# EAGLE design SSTuino_Evo (EAGLE 9.6.2)

## Sheet 1 of 2
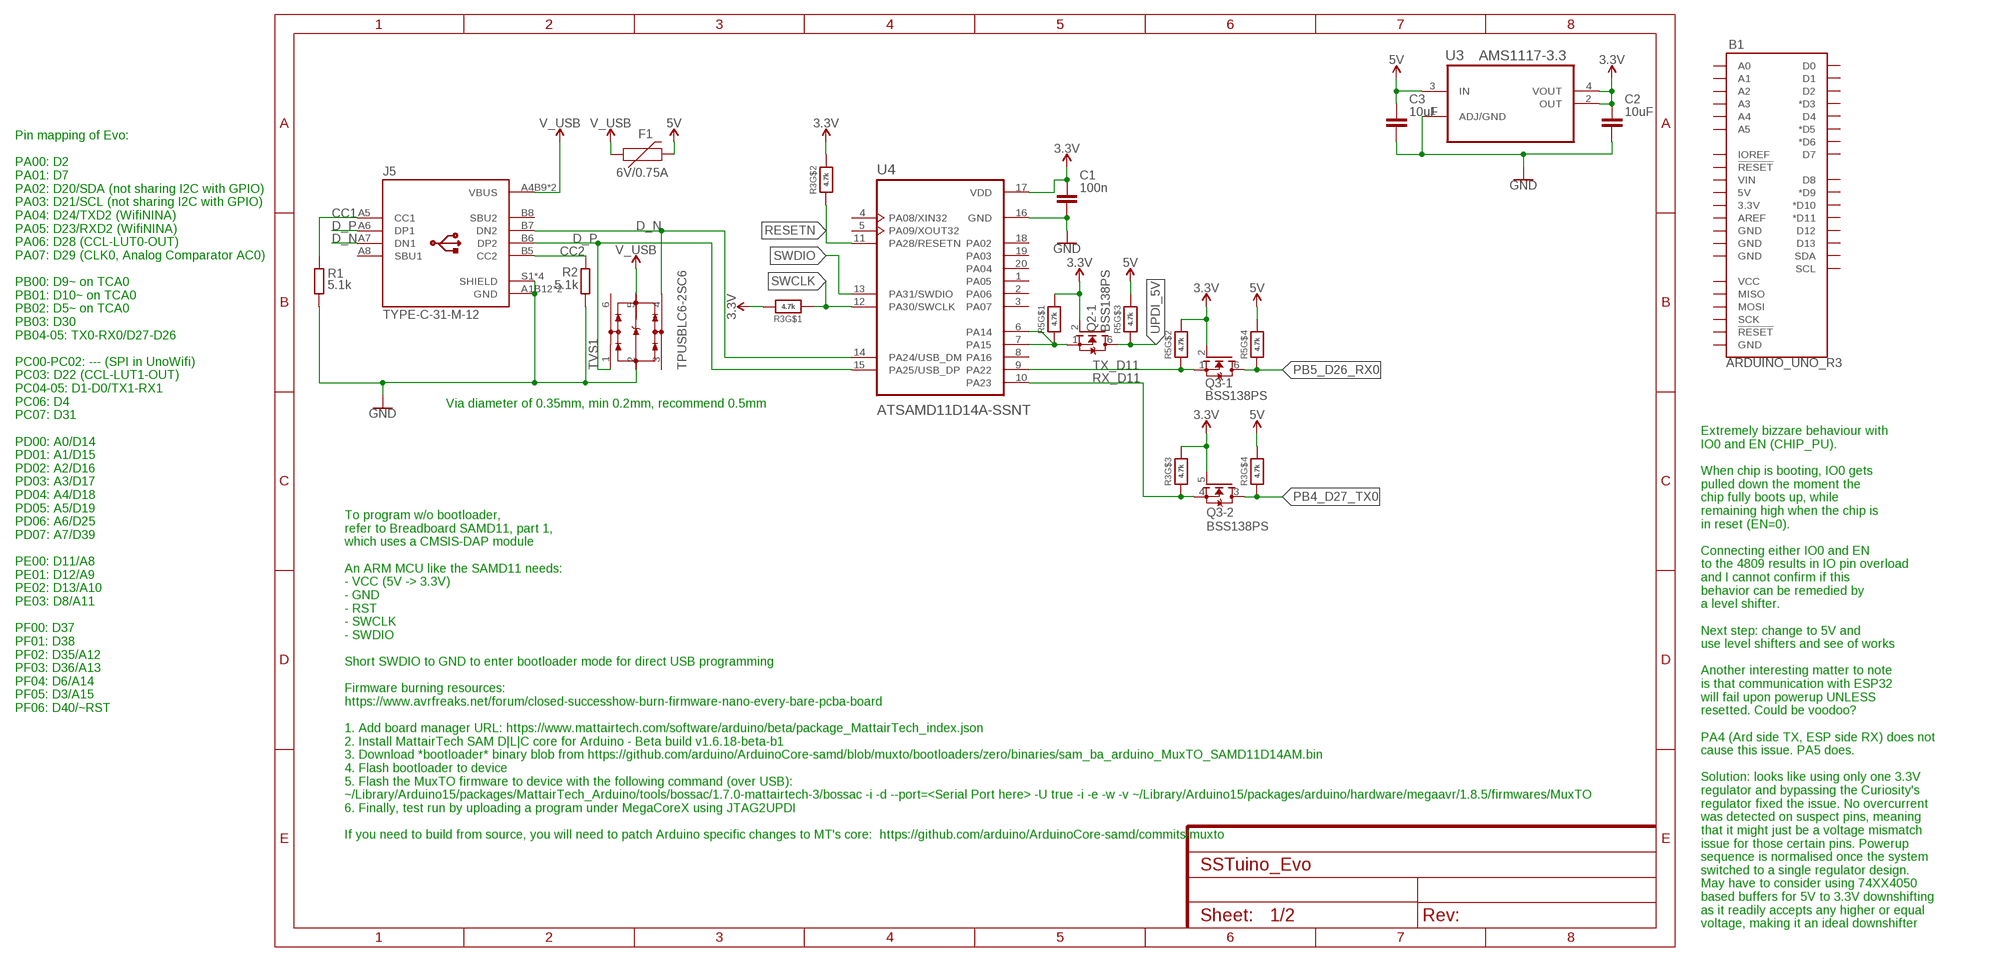
[diagram p0: schematic, sheet 1]

### Parts
B1  ARDUINO_UNO_R3  [ARDUINO_R3]
C1  100n  C_CHIP-0402(1005-METRIC)  [CAPC1005X60]
C2  10uF  C_CHIP-0603(1608-METRIC)  [CAPC1608X85]
C3  10uF  C_CHIP-0603(1608-METRIC)  [CAPC1608X85]
F1  6V/0.75A  PPTC_THREE-QUARTER-AMP  [1206]
J5  TYPE-C-31-M-12  [HRO_TYPE-C-31-M-12]
Q2  BSS138PS  [ARDUINO-TRANSISTORS_SOT363]
Q3  BSS138PS  [ARDUINO-TRANSISTORS_SOT363]
R1  5.1k  R_CHIP-0402(1005-METRIC)  [RESC1005X40]
R2  5.1k  R_CHIP-0402(1005-METRIC)  [RESC1005X40]
R3  4.7k  RESISTOR_4PACK0402  [RESPACK_4X0402]
R5  4.7k  RESISTOR_4PACK0402  [RESPACK_4X0402]
TVS1  TPUSBLC6-2SC6  [SOT95P280X110-6N]
U3  AMS1117-3.3  LM1117MP-3.3  [SOT230P696X180-4N]
U4  ATSAMD11D14A-SSNT  [SOIC127P1030X265-20N]

### Nets
3.3V: C1.1 C2.1 Q2.2(-1:G) Q3.2(-1:G) Q3.5(-2:G) R3.6 R3.7 R3.8 R5.7 R5.8 U3.2(OUT) U3.4(VOUT) U4.17(VDD) ; also sheet 2
5V: C3.1 F1.2 R3.5 R5.5 R5.6 U3.3(IN) ; also sheet 2
CC1: J5.A5(CC1) R1.1
CC2: J5.B5(CC2) R2.2
D_N [differential]: J5.A7(DN1) J5.B7(DN2) TVS1.4(IO3) U4.14(PA24/USB_DM)
D_P [differential]: J5.A6(DP1) J5.B6(DP2) TVS1.1(IO1) U4.15(PA25/USB_DP)
GND: C1.2 C2.2 C3.2 J5.A1B12(GND) J5.B1A12(GND) J5.S1(SHIELD) J5.S2(SHIELD) J5.S3(SHIELD) J5.S4(SHIELD) R1.2 R2.1 TVS1.2(VSS) U3.1(ADJ/GND) U4.16(GND) ; also sheet 2
PB4_D27_TX0: Q3.3(-2:D) R3.4 ; also sheet 2
PB5_D26_RX0: Q3.6(-1:D) R5.4 ; also sheet 2
RESETN: R3.2 U4.11(PA28/RESETN) ; also sheet 2
RX_D11: Q3.4(-2:S) R3.3 U4.10(PA23)
SWCLK: R3.1 U4.12(PA30/SWCLK) ; also sheet 2
SWDIO: U4.13(PA31/SWDIO) ; also sheet 2
TX_D11: Q3.1(-1:S) R5.2 U4.9(PA22)
UPDI_3V3: Q2.1(-1:S) R5.1 U4.6(PA14) U4.7(PA15)
UPDI_5V: Q2.6(-1:D) R5.3 ; also sheet 2
V_USB: F1.1 J5.A4B9(VBUS) J5.B4A9(VBUS) TVS1.5(VCC)
Unconnected: B1.3.3V B1.5V B1.A0 B1.A1 B1.A2 B1.A3 B1.A4 B1.A5 B1.AREF B1.D0 B1.D1 B1.D2 B1.D3(*D3) B1.D4 B1.D5(*D5) B1.D6(*D6) B1.D7 B1.D8 B1.D9(*D9) B1.D10(*D10) B1.D11(*D11) B1.D12 B1.D13 B1.GND@1(GND) B1.GND@2(GND) B1.GND@3(GND) B1.GND@4(GND) B1.IOREF B1.MISO B1.MOSI B1.RESET@1(!RESET!) B1.RESET@2(!RESET!) B1.SCK B1.SCL B1.SDA B1.VCC B1.VIN J5.A8(SBU1) J5.B8(SBU2) TVS1.3(IO2) TVS1.6(IO4) U4.1(PA05) U4.2(PA06) U4.3(PA07) U4.4(PA08/XIN32) U4.5(PA09/XOUT32) U4.8(PA16) U4.18(PA02) U4.19(PA03) U4.20(PA04)

### Notes on the sheet
- Via diameter of 0.35mm, min 0.2mm, recommend 0.5mm
- Pin mapping of Evo:
  
  PA00: D2
  PA01: D7
  PA02: D20/SDA (not sharing I2C with GPIO)
  PA03: D21/SCL (not sharing I2C with GPIO)
  PA04: D24/TXD2 (WifiNINA)
  PA05: D23/RXD2 (WifiNINA)
  PA06: D28 (CCL-LUT0-OUT)
  PA07: D29 (CLK0, Analog Comparator AC0)
  
  PB00: D9~ on TCA0
  PB01: D10~ on TCA0
  PB02: D5~ on TCA0
  PB03: D30
  PB04-05: TX0-RX0/D27-D26
  
  PC00-PC02: --- (SPI in UnoWifi)
  PC03: D22 (CCL-LUT1-OUT)
  PC04-05: D1-D0/TX1-RX1
  PC06: D4
  PC07: D31
  
  PD00: A0/D14
  PD01: A1/D15
  PD02: A2/D16
  PD03: A3/D17
  PD04: A4/D18
  PD05: A5/D19
  PD06: A6/D25
  PD07: A7/D39
  
  PE00: D11/A8
  PE01: D12/A9
  PE02: D13/A10
  PE03: D8/A11
  
  PF00: D37
  PF01: D38
  PF02: D35/A12
  PF03: D36/A13
  PF04: D6/A14
  PF05: D3/A15
  PF06: D40/~RST
- To program w/o bootloader,
  refer to Breadboard SAMD11, part 1,
  which uses a CMSIS-DAP module
  
  An ARM MCU like the SAMD11 needs:
  - VCC (5V -> 3.3V)
  - GND
  - RST
  - SWCLK
  - SWDIO
  
  Short SWDIO to GND to enter bootloader mode for direct USB programming
  
  Firmware burning resources:
  https://www.avrfreaks.net/forum/closed-successhow-burn-firmware-nano-every-bare-pcba-board
  
  1. Add board manager URL: https://www.mattairtech.com/software/arduino/beta/package_MattairTech_index.json
  2. Install MattairTech SAM D|L|C core for Arduino - Beta build v1.6.18-beta-b1
  3. Download *bootloader* binary blob from https://github.com/arduino/ArduinoCore-samd/blob/muxto/bootloaders/zero/binaries/sam_ba_arduino_MuxTO_SAMD11D14AM.bin
  4. Flash bootloader to device
  5. Flash the MuxTO firmware to device with the following command (over USB): 
  ~/Library/Arduino15/packages/MattairTech_Arduino/tools/bossac/1.7.0-mattairtech-3/bossac -i -d --port=<Serial Port here> -U true -i -e -w -v ~/Library/Arduino15/packages/arduino/hardware/megaavr/1.8.5/firmwares/MuxTO
  6. Finally, test run by uploading a program under MegaCoreX using JTAG2UPDI
  
  If you need to build from source, you will need to patch Arduino specific changes to MT's core:  https://github.com/arduino/ArduinoCore-samd/commits/muxto
- Extremely bizzare behaviour with
  IO0 and EN (CHIP_PU). 
  
  When chip is booting, IO0 gets 
  pulled down the moment the 
  chip fully boots up, while 
  remaining high when the chip is
  in reset (EN=0).
  
  Connecting either IO0 and EN
  to the 4809 results in IO pin overload
  and I cannot confirm if this
  behavior can be remedied by
  a level shifter. 
  
  Next step: change to 5V and
  use level shifters and see of works
  
  Another interesting matter to note
  is that communication with ESP32
  will fail upon powerup UNLESS
  resetted. Could be voodoo?
  
  PA4 (Ard side TX, ESP side RX) does not
  cause this issue. PA5 does.
  
  Solution: looks like using only one 3.3V 
  regulator and bypassing the Curiosity's
  regulator fixed the issue. No overcurrent
  was detected on suspect pins, meaning
  that it might just be a voltage mismatch
  issue for those certain pins. Powerup
  sequence is normalised once the system
  switched to a single regulator design.
  May have to consider using 74XX4050
  based buffers for 5V to 3.3V downshifting
  as it readily accepts any higher or equal
  voltage, making it an ideal downshifter

## Sheet 2 of 2
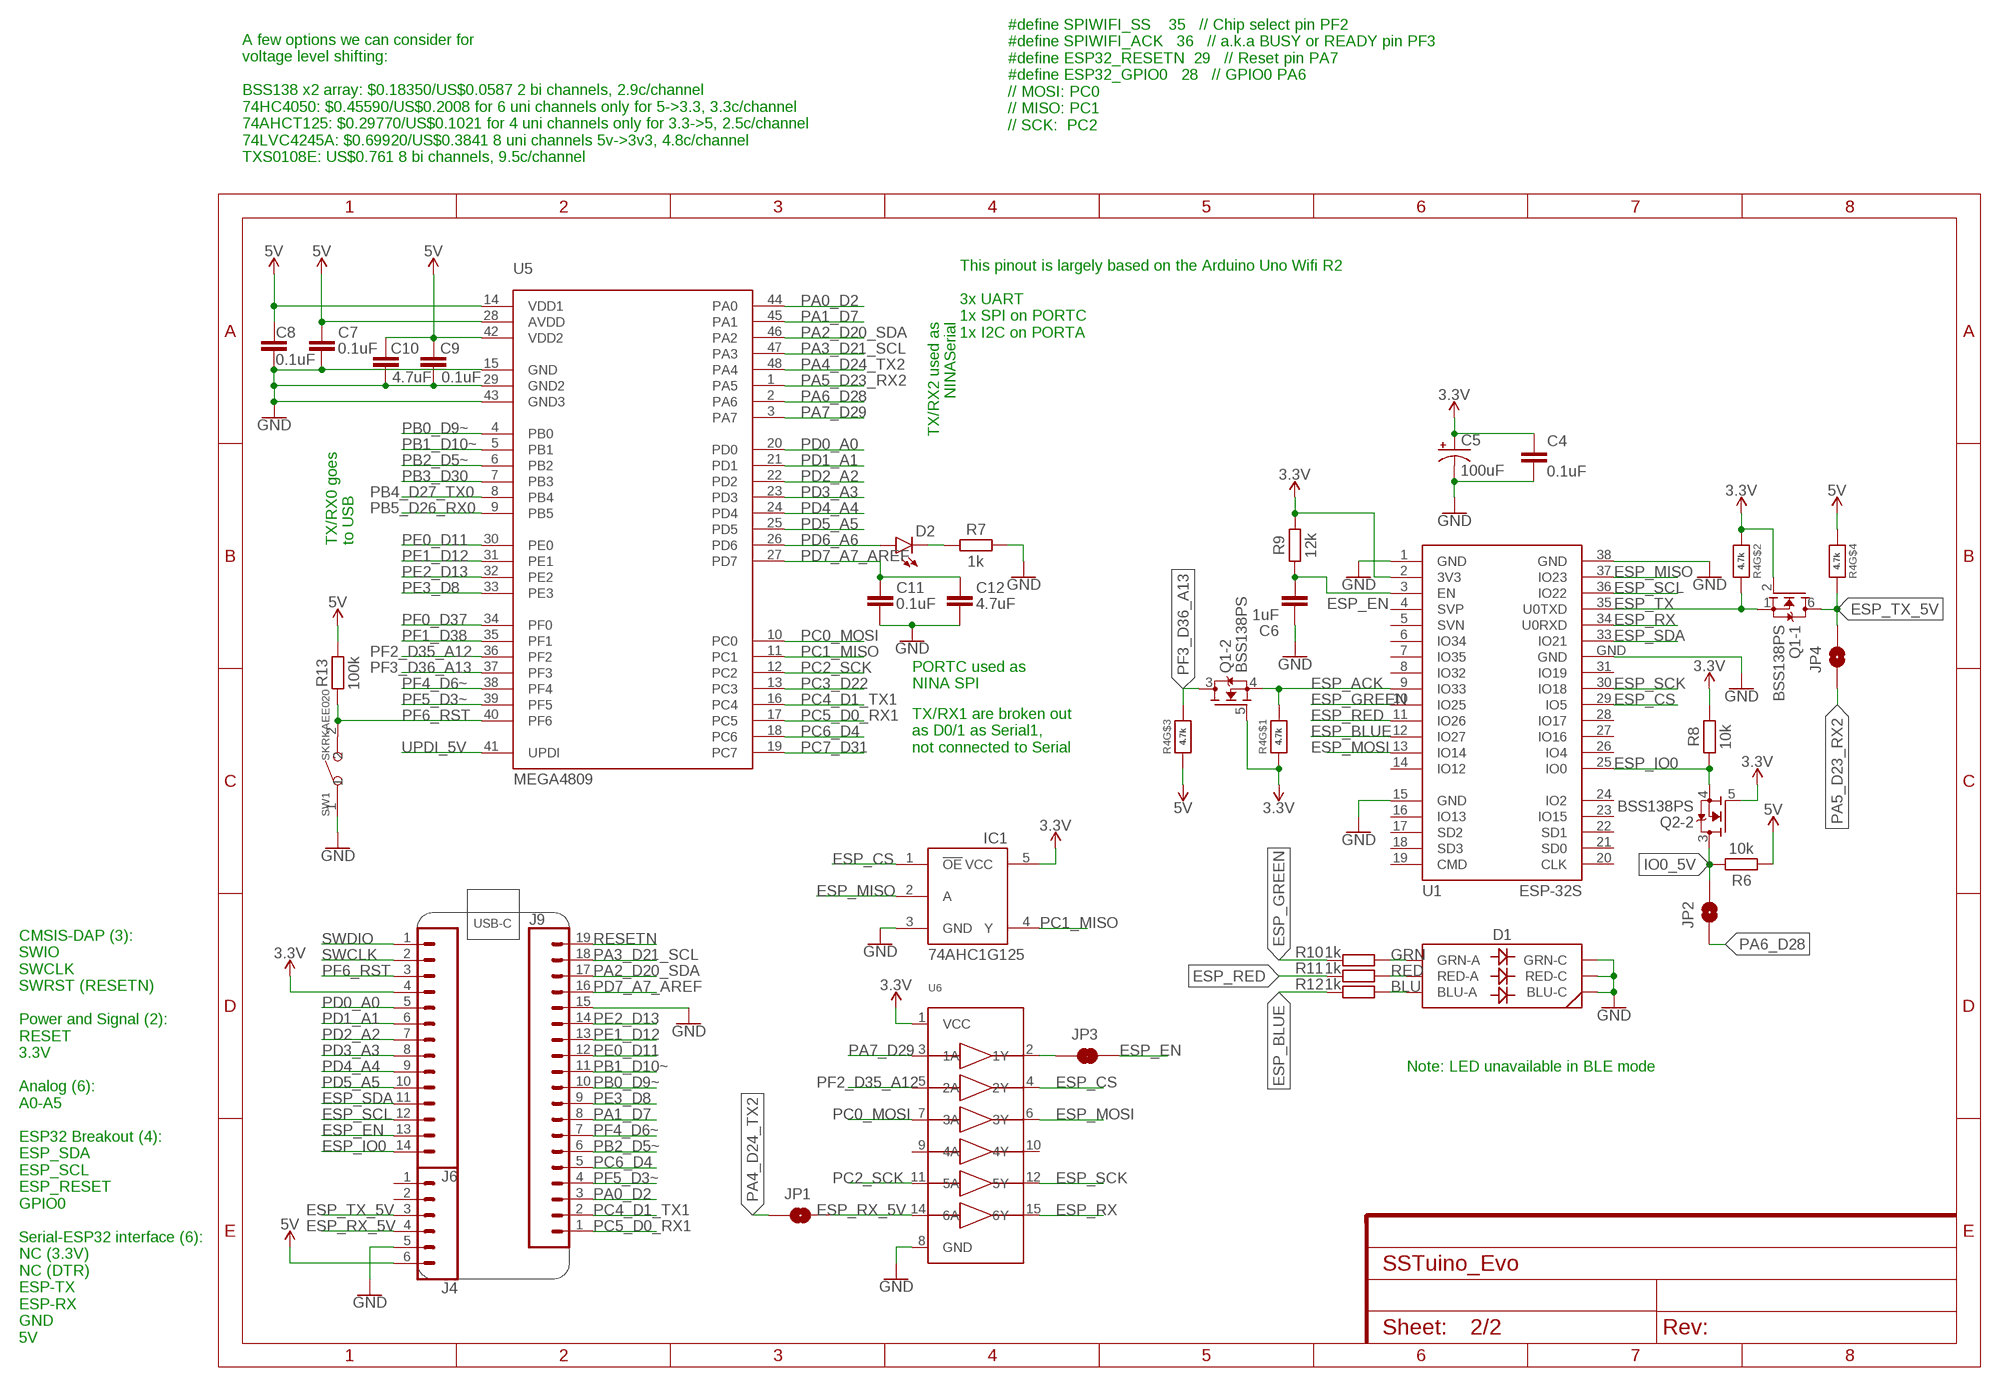
[diagram p1: schematic, sheet 2]

### Parts
C4  0.1uF  C_CHIP-0402(1005-METRIC)  [CAPC1005X60]
C5  100uF  C-POL-US_TANTALUM-1206(3216-METRIC)  [CAPMP3216X180N]
C6  1uF  C_CHIP-0402(1005-METRIC)  [CAPC1005X60]
C7  0.1uF  C_CHIP-0402(1005-METRIC)  [CAPC1005X60]
C8  0.1uF  C_CHIP-0402(1005-METRIC)  [CAPC1005X60]
C9  0.1uF  C_CHIP-0402(1005-METRIC)  [CAPC1005X60]
C10  4.7uF  C_CHIP-0402(1005-METRIC)  [CAPC1005X60]
C11  0.1uF  C_CHIP-0402(1005-METRIC)  [CAPC1005X60]
C12  4.7uF  C_CHIP-0402(1005-METRIC)  [CAPC1005X60]
D1  LED-RGBTC5050RGBF08  [LED-TRICOLOR-5050]
D2  LED0603  [LED-0603]
IC1  74AHC1G125  [SOT23-5L]
J4  CONN_06NO_SILK_FEMALE_PTH  [1X06_NO_SILK]
J6  CONN_14NO_SILK  [1X14_NO_SILK]
J9  CONN_191X19_NO_SILK  [1X19_NO_SILK]
JP1  JUMPER-SMT_2_NO_SILK  [SMT-JUMPER_2_NO_SILK]
JP2  JUMPER-SMT_2_NO_SILK  [SMT-JUMPER_2_NO_SILK]
JP3  JUMPER-SMT_2_NC_TRACE_SILK  [SMT-JUMPER_2_NC_TRACE_SILK]
JP4  JUMPER-SMT_2_NO_SILK  [SMT-JUMPER_2_NO_SILK]
Q1  BSS138PS  [ARDUINO-TRANSISTORS_SOT363]
R4  4.7k  RESISTOR_4PACK0402  [RESPACK_4X0402]
R6  10k  R_CHIP-0402(1005-METRIC)  [RESC1005X40]
R7  1k  R_CHIP-0402(1005-METRIC)  [RESC1005X40]
R8  10k  R_CHIP-0402(1005-METRIC)  [RESC1005X40]
R9  12k  R_CHIP-0402(1005-METRIC)  [RESC1005X40]
R10  1k  R_CHIP-0402(1005-METRIC)  [RESC1005X40]
R11  1k  R_CHIP-0402(1005-METRIC)  [RESC1005X40]
R12  1k  R_CHIP-0402(1005-METRIC)  [RESC1005X40]
R13  100k  R_CHIP-0402(1005-METRIC)  [RESC1005X40]
SW1  SKRKAEE020  SMD-BUTTON(2P-3.9X2.9X1.5+0.4MM)-SKRKAEE020  [SW2-2.6-3.9X2.9X1.5+0.4MM]
U1  ESP-32S  [ESP-32S]
U5  MEGA4809  [TQFP48]
U6  74HC4050DTSSOP  [TSSOP16]

### Nets
3.3V: C4.1 C5.1(+) IC1.5(VCC) J6.4 Q1.2(-1:G) Q1.5(-2:G) Q2.5(-2:G) R4.1 R4.2 R8.2 R9.2 U1.2(3V3) U6.1(VCC) ; also sheet 1
5V: C7.1 C8.1 C9.1 C10.1 J4.6 R4.3 R4.4 R6.1 R13.2 U5.14(VDD1) U5.28(AVDD) U5.42(VDD2) ; also sheet 1
BLU: D1.6(BLU-A) R12.2
ESP_ACK: Q1.4(-2:S) R4.8 U1.9(IO33)
ESP_BLUE: R12.1 U1.12(IO27)
ESP_CS: IC1.1(!OE) U1.29(IO5) U6.4(2Y)
ESP_EN: C6.2 J6.13 JP3.2 R9.1 U1.3(EN)
ESP_GREEN: R10.1 U1.10(IO25)
ESP_IO0: J6.14 Q2.4(-2:S) R8.1 U1.25(IO0)
ESP_MISO: IC1.2(A) U1.37(IO23)
ESP_MOSI: U1.13(IO14) U6.6(3Y)
ESP_RED: R11.1 U1.11(IO26)
ESP_RX: U1.34(U0RXD) U6.15(6Y)
ESP_RX_5V: J4.4 JP1.2 U6.14(6A)
ESP_SCK: U1.30(IO18) U6.12(5Y)
ESP_SCL: J6.12 U1.36(IO22)
ESP_SDA: J6.11 U1.33(IO21)
ESP_TX: Q1.1(-1:S) R4.7 U1.35(U0TXD)
ESP_TX_5V: J4.3 JP4.2 Q1.6(-1:D) R4.5
GND: C4.2 C5.2(-) C6.1 C7.2 C8.2 C9.2 C10.2 C11.2 C12.2 D1.1(BLU-C) D1.2(RED-C) D1.3(GRN-C) IC1.3(GND) J4.5 J9.15 R7.2 SW1.1 U1.1(GND) U1.15(GND) U1.38(GND) U1.GND U5.15(GND) U5.29(GND2) U5.43(GND3) U6.8(GND) ; also sheet 1
GRN: D1.4(GRN-A) R10.2
IO0_5V: JP2.2 Q2.3(-2:D) R6.2
N$2: D2.C R7.1
N$4: JP3.1 U6.2(1Y)
PA0_D2: J9.3 U5.44(PA0)
PA1_D7: J9.8 U5.45(PA1)
PA2_D20_SDA: J9.17 U5.46(PA2)
PA3_D21_SCL: J9.18 U5.47(PA3)
PA4_D24_TX2: JP1.1 U5.48(PA4)
PA5_D23_RX2: JP4.1 U5.1(PA5)
PA6_D28: JP2.1 U5.2(PA6)
PA7_D29: U5.3(PA7) U6.3(1A)
PB0_D9~: J9.10 U5.4(PB0)
PB1_D10~: J9.11 U5.5(PB1)
PB2_D5~: J9.6 U5.6(PB2)
PB3_D30: U5.7(PB3)
PB4_D27_TX0: U5.8(PB4) ; also sheet 1
PB5_D26_RX0: U5.9(PB5) ; also sheet 1
PC0_MOSI: U5.10(PC0) U6.7(3A)
PC1_MISO: IC1.4(Y) U5.11(PC1)
PC2_SCK: U5.12(PC2) U6.11(5A)
PC3_D22: U5.13(PC3)
PC4_D1_TX1: J9.2 U5.16(PC4)
PC5_D0_RX1: J9.1 U5.17(PC5)
PC6_D4: J9.5 U5.18(PC6)
PC7_D31: U5.19(PC7)
PD0_A0: J6.5 U5.20(PD0)
PD1_A1: J6.6 U5.21(PD1)
PD2_A2: J6.7 U5.22(PD2)
PD3_A3: J6.8 U5.23(PD3)
PD4_A4: J6.9 U5.24(PD4)
PD5_A5: J6.10 U5.25(PD5)
PD6_A6: D2.A U5.26(PD6)
PD7_A7_AREF: C11.1 C12.1 J9.16 U5.27(PD7)
PE0_D11: J9.12 U5.30(PE0)
PE1_D12: J9.13 U5.31(PE1)
PE2_D13: J9.14 U5.32(PE2)
PE3_D8: J9.9 U5.33(PE3)
PF0_D37: U5.34(PF0)
PF1_D38: U5.35(PF1)
PF2_D35_A12: U5.36(PF2) U6.5(2A)
PF3_D36_A13: Q1.3(-2:D) R4.6 U5.37(PF3)
PF4_D6~: J9.7 U5.38(PF4)
PF5_D3~: J9.4 U5.39(PF5)
PF6_RST: J6.3 R13.1 SW1.2 U5.40(PF6)
RED: D1.5(RED-A) R11.2
RESETN: J9.19 ; also sheet 1
SWCLK: J6.2 ; also sheet 1
SWDIO: J6.1 ; also sheet 1
UPDI_5V: U5.41(UPDI) ; also sheet 1
Unconnected: J4.1 J4.2 U1.4(SVP) U1.5(SVN) U1.6(IO34) U1.7(IO35) U1.8(IO32) U1.14(IO12) U1.16(IO13) U1.17(SD2) U1.18(SD3) U1.19(CMD) U1.20(CLK) U1.21(SD0) U1.22(SD1) U1.23(IO15) U1.24(IO2) U1.26(IO4) U1.27(IO16) U1.28(IO17) U1.31(IO19) U6.9(4A) U6.10(4Y)

### Notes on the sheet
- #define SPIWIFI_SS    35   // Chip select pin PF2
  #define SPIWIFI_ACK   36   // a.k.a BUSY or READY pin PF3
  #define ESP32_RESETN  29   // Reset pin PA7
  #define ESP32_GPIO0   28   // GPIO0 PA6
  // MOSI: PC0
  // MISO: PC1
  // SCK:  PC2
- A few options we can consider for
  voltage level shifting:
  
  BSS138 x2 array: $0.18350/US$0.0587 2 bi channels, 2.9c/channel
  74HC4050: $0.45590/US$0.2008 for 6 uni channels only for 5->3.3, 3.3c/channel
  74AHCT125: $0.29770/US$0.1021 for 4 uni channels only for 3.3->5, 2.5c/channel
  74LVC4245A: $0.69920/US$0.3841 8 uni channels 5v->3v3, 4.8c/channel
  TXS0108E: US$0.761 8 bi channels, 9.5c/channel
- TX/RX2 used as
  NINASerial
- This pinout is largely based on the Arduino Uno Wifi R2
  
  3x UART
  1x SPI on PORTC
  1x I2C on PORTA
- TX/RX0 goes
  to USB
- PORTC used as
  NINA SPI
- TX/RX1 are broken out 
  as D0/1 as Serial1,
  not connected to Serial
- USB-C
- Note: LED unavailable in BLE mode
- CMSIS-DAP (3):
  SWIO
  SWCLK
  SWRST (RESETN)
  
  Power and Signal (2):
  RESET
  3.3V
  
  Analog (6):
  A0-A5
  
  ESP32 Breakout (4):
  ESP_SDA
  ESP_SCL
  ESP_RESET
  GPIO0
  
  Serial-ESP32 interface (6):
  NC (3.3V)
  NC (DTR)
  ESP-TX
  ESP-RX
  GND
  5V

## Library data of the parts
B1 = SparkFun-Boards:ARDUINO_UNO_R3: Arduino R3 Footprint with SPI header Arduino Uno R3 Compatible Footprint. Matches PCB size of the original board. SparkFun Products: SAMD21 Dev Breakout <https://www.sparkfun.com/products/13672> RedBoard <https://www.sparkfun.com/products/12757> R3 Stackable Headers <https://www.sparkfun.com/products/11417>
C1-C4 C6-C12 = Capacitor:C: Capacitor - Generic; CATEGORY: Capacitor
C5 = Capacitor:C-POL-US: Capacitor Polarised - ANSI; CATEGORY: Capacitor
D1 = D3ltav's Custom:LED-RGB: LED-RGB 6 pin RGB LED (no common connector) Warning: please check and double check your pinout vs. the datasheet! 5050 SMD LEDs are commonly packaged in all sorts of weird, non-standard pinouts. This footprint and symbol is only applicable to the LED mentioned below Packages: LED-TRICOLOR-5050 - Based on TC5050RGBF08 RGB LED <https://datasheet.lcsc.com/szlcsc/2009231707_TCWIN-TC5050RGBF08-3CJH-AF53A_C784540.pdf>; PROD_ID: DIO-10298
D2 = SparkFun-LED:LED: LED (Generic) Standard schematic elements and footprints for 5mm, 3mm, 1206, and 0603 sized LEDs. Generic LEDs with no color specified.
F1 = SparkFun-Fuses:PPTC: Resettable Fuse PPTC Resettable Fuse. Really a sort of resistor with a polymeric positive temperature coefficient whose resistance increases dramatically with an increase in temperature. When heated by the power passing through the resistance rises causing the current to be limited, protecting the circuit. This is achieved by the transition of the polymer from a crystalline to an amorphous state where the conductive carbon separates breaking the conductive pathways found in the cool crystalline structure. When a PPTC cools back down it resumes conducting letting the circuit turn back on. SparkFun Products: SparkFun RedBoard - Programmed with Arduino <https://www.sparkfun.com/products/12757> Pro Micro - 5V/16MHz <https://www.sparkfun.com/products/12640> Arduino Pro 328 - 5V/16MHz <https://www.sparkfun.com/products/10915> MP3 Trigger <https://www.sparkfun.com/products/13720>; LCSC_PART: C99563; PROD_ID: RES-11150
IC1 = adafruit:74AHC1G125; LCSC_PART: C124295
J4 = SparkFun-Connectors:CONN_06: Multi connection point. Often used as Generic Header-pin footprint for 0.1 inch spaced/style header connections On any of the 0.1 inch spaced packages, you can populate with these: Break Away Headers - Straight <https://www.sparkfun.com/products/116> (PRT-00116) Break Away Male Headers - Right Angle <https://www.sparkfun.com/products/553> (PRT-00553) Female Headers <https://www.sparkfun.com/products/115> (PRT-00115) Break Away Headers - Machine Pin <https://www.sparkfun.com/products/117> (PRT-00117) Break Away Female Headers - Swiss Machine Pin <https://www.sparkfun.com/products/743> (PRT-00743) Arduino Stackable Header - 6 Pin <https://www.sparkfun.com/products/9280> (PRT-09280) For SCREWTERMINALS and SPRING TERMINALS visit here: Screw Terimnals on SparkFun.com <https://www.sparkfun.com/search/results?term=Screw+Terminals> (5mm/3.5mm/2.54mm spacing) This device is also useful as a general connection point to wire up your design to another part of your project. Our various solder wires solder well into these plated through hole pads. Hook-Up Wire - Assortment (Stranded, 22 AWG) <https://www.sparkfun.com/products/11375> (PRT-11375) Hook-Up Wire - Assortment (Solid Core, 22 AWG) <https://www.sparkfun.com/products/11367> (PRT-11367) View the entire wire category on our website here <https://www.sparkfun.com/categories/141>; PROD_ID: CONN-08437
J5 = D3ltav's Custom:TYPE-C-31-M-12: USB Connectors 24 Receptacle 1 8.94*7.3mm RoHS Check prices <https://pricing.snapeda.com/parts/TYPE-C-31-M-12/HRO%20Electronics%20Co.%2C%20Ltd./view-part?ref=eda>; AVAILABILITY: No availability data; DESCRIPTION: USB Connectors 24 Receptacle 1 8.94*7.3mm RoHS; LCSC_PART: C165948; MF: HRO Electronics Co., Ltd.; MP: TYPE-C-31-M-12; PACKAGE: Package; PRICE: None
J6 = SparkFun-Connectors:CONN_14: Multi connection point. Often used as Generic Header-pin footprint for 0.1 inch spaced/style header connections On any of the 0.1 inch spaced packages, you can populate with these: Break Away Headers - Straight <https://www.sparkfun.com/products/116> (PRT-00116) Break Away Male Headers - Right Angle <https://www.sparkfun.com/products/553> (PRT-00553) Female Headers <https://www.sparkfun.com/products/115> (PRT-00115) Break Away Headers - Machine Pin <https://www.sparkfun.com/products/117> (PRT-00117) Break Away Female Headers - Swiss Machine Pin <https://www.sparkfun.com/products/743> (PRT-00743) For SCREWTERMINALS and SPRING TERMINALS visit here: Screw Terimnals on SparkFun.com <https://www.sparkfun.com/search/results?term=Screw+Terminals> (5mm/3.5mm/2.54mm spacing) This device is also useful as a general connection point to wire up your design to another part of your project. Our various solder wires solder well into these plated through hole pads. Hook-Up Wire - Assortment (Stranded, 22 AWG) <https://www.sparkfun.com/products/11375> (PRT-11375) Hook-Up Wire - Assortment (Solid Core, 22 AWG) <https://www.sparkfun.com/products/11367> (PRT-11367) View the entire wire category on our website here <https://www.sparkfun.com/categories/141> Special notes: Molex polarized connector foot print use with SKU : PRT-08231 with associated crimp pins and housings. 1MM SMD Version SKU: PRT-10208 NOTES ON THE VARIANTS LOCK and LOCK_LONGPADS... This footprint was designed to help hold the alignment of a through-hole component (i.e. 6-pin header) while soldering it into place. You may notice that each hole has been shifted either up or down by 0.005 of an inch from it's more standard position (which is a perfectly straight line). This slight alteration caused the pins (the squares in the middle) to touch the edges of the holes. Because they are alternating, it causes a "brace" to hold the component in place. 0.005 has proven to be the perfect amount of "off-center" position when using our standard breakaway headers. Although looks a little odd when you look at the bare footprint, once you have a header in there, the alteration is very hard to notice. Also,if you push a header all the way into place, it is covered up entirely on the bottom side.
J9 = SparkFun-Connectors:CONN_19: Multi connection point. Often used as Generic Header-pin footprint for 0.1 inch spaced/style header connections On any of the 0.1 inch spaced packages, you can populate with these: Break Away Headers - Straight <https://www.sparkfun.com/products/116> (PRT-00116) Break Away Male Headers - Right Angle <https://www.sparkfun.com/products/553> (PRT-00553) Female Headers <https://www.sparkfun.com/products/115> (PRT-00115) Break Away Headers - Machine Pin <https://www.sparkfun.com/products/117> (PRT-00117) Break Away Female Headers - Swiss Machine Pin <https://www.sparkfun.com/products/743> (PRT-00743) For SCREWTERMINALS and SPRING TERMINALS visit here: Screw Terimnals on SparkFun.com <https://www.sparkfun.com/search/results?term=Screw+Terminals> (5mm/3.5mm/2.54mm spacing) This device is also useful as a general connection point to wire up your design to another part of your project. Our various solder wires solder well into these plated through hole pads. Hook-Up Wire - Assortment (Stranded, 22 AWG) <https://www.sparkfun.com/products/11375> (PRT-11375) Hook-Up Wire - Assortment (Solid Core, 22 AWG) <https://www.sparkfun.com/products/11367> (PRT-11367) View the entire wire category on our website here <https://www.sparkfun.com/categories/141> Special notes: Molex polarized connector foot print use with SKU : PRT-08231 with associated crimp pins and housings. 1MM SMD Version SKU: PRT-10208 NOTES ON THE VARIANTS LOCK and LOCK_LONGPADS... This footprint was designed to help hold the alignment of a through-hole component (i.e. 6-pin header) while soldering it into place. You may notice that each hole has been shifted either up or down by 0.005 of an inch from it's more standard position (which is a perfectly straight line). This slight alteration caused the pins (the squares in the middle) to touch the edges of the holes. Because they are alternating, it causes a "brace" to hold the component in place. 0.005 has proven to be the perfect amount of "off-center" position when using our standard breakaway headers. Although looks a little odd when you look at the bare footprint, once you have a header in there, the alteration is very hard to notice. Also,if you push a header all the way into place, it is covered up entirely on the bottom side.
JP1 JP2 JP4 = SparkFun-Jumpers:JUMPER-SMT_2_NO: Normally open jumper This jumper has two pads in close proximity to each other. Apply solder to close the connection. Round pads are easier to solder for beginners, but are a lot larger. SparkFun Product that uses the round pads: SparkFun EL Sequencer <https://www.sparkfun.com/products/12781>
JP3 = SparkFun-Jumpers:JUMPER-SMT_2_NC_TRACE: Normally closed trace jumper This jumper has a trace between two pads so it's normally closed (NC). Use a razor knife to open the connection. For best results follow the IPC guidelines for cutting traces: Cutout at least 0.063 mm (0.005 in). Remove all loose material to clean up the cut area. Seal the cut with an approved epoxy. Reapply solder to reclose the connection.
Q1-Q3 = D3ltav's Custom:BSS138PS: MOSFET 2N-CH 60V 0.32A 6TSSOP; CODE-ARDUINO: 2323; DATASHEET: https://assets.nexperia.com/documents/data-sheet/BSS138PS.pdf; DISTRIBUTOR-LINK: http://www.digikey.com/product-detail/en/nxp-semiconductors/BSS138PS,115/568-8393-1-ND/2763927; DISTRIBUTOR-PN: 568-8393-1-ND; LCSC_PART: C193381; MANUFACTURER: NXP; MANUFACTURER-PN: BSS138PS,115
R1 R2 R6-R13 = Resistor:R: Resistor Fixed - Generic; CATEGORY: Resistor; SUB-CATEGORY: Fixed
R3-R5 = D3ltav's Custom:RESISTOR_4PACK: Resistor Packs (4 resistors) 4 x 0603 10K 1/16W - Digikey: YC164J-10KCT-ND; LCSC_PART: C1980
SW1 = D3ltav's Custom:SMD-BUTTON(2P-3.9X2.9X1.5+0.4MM): 311020047; LCSC_PART: C115357; MPN: SKRKAEE020
TVS1 = D3ltav's Custom:TPUSBLC6-2SC6: TPUSBLC6-2SC6 Low Capacitance 2-Line ESD Protection www.sot23.com.tw; LCSC_PART: C558442
U1 = esp32:ESP-32S: Ai-Thinker ESP-32S
U3 = D3ltav's Custom:LM1117MP-3.3: Linear regulators; LCSC_PART: C6186; MPN: LM1117MP-3.3; OC_FARNELL: 9778195; OC_NEWARK: 41K3470; PACKAGE: SOT223-3; SUPPLIER: NationalSemiconductor
U4 = D3ltav's Custom:ATSAMD11D14A-SSNT; AVAILABILITY: In Stock; DESCRIPTION: ARM® Cortex®-M0+ SAM D11D Microcontroller IC 32-Bit 48MHz 16KB (16K x 8) FLASH 20-SOIC; LCSC_PART: C2053599; MF: Microchip; MP: ATSAMD11D14A-SSNT; PACKAGE: SOIC-20 Microchip; PRICE: None
U5 = microwavemont_ATMEGA4809:MEGA4809; LCSC_PART: C189475
U6 = D3ltav's Custom:74HC4050D: 6-channel level shifter 74HC4050D - 2V-6V Supply SOIC16 Digikey: 74HC4050D,653-ND Mouser: 771-74HC4050D-T TSSOP16 Digikey: 296-9215-1-ND Mouser:; LCSC_PART: C43181

## Net classes
0 default: width 0.254 mm, drill 0.35 mm
1 differential: width 0.254 mm

## Board
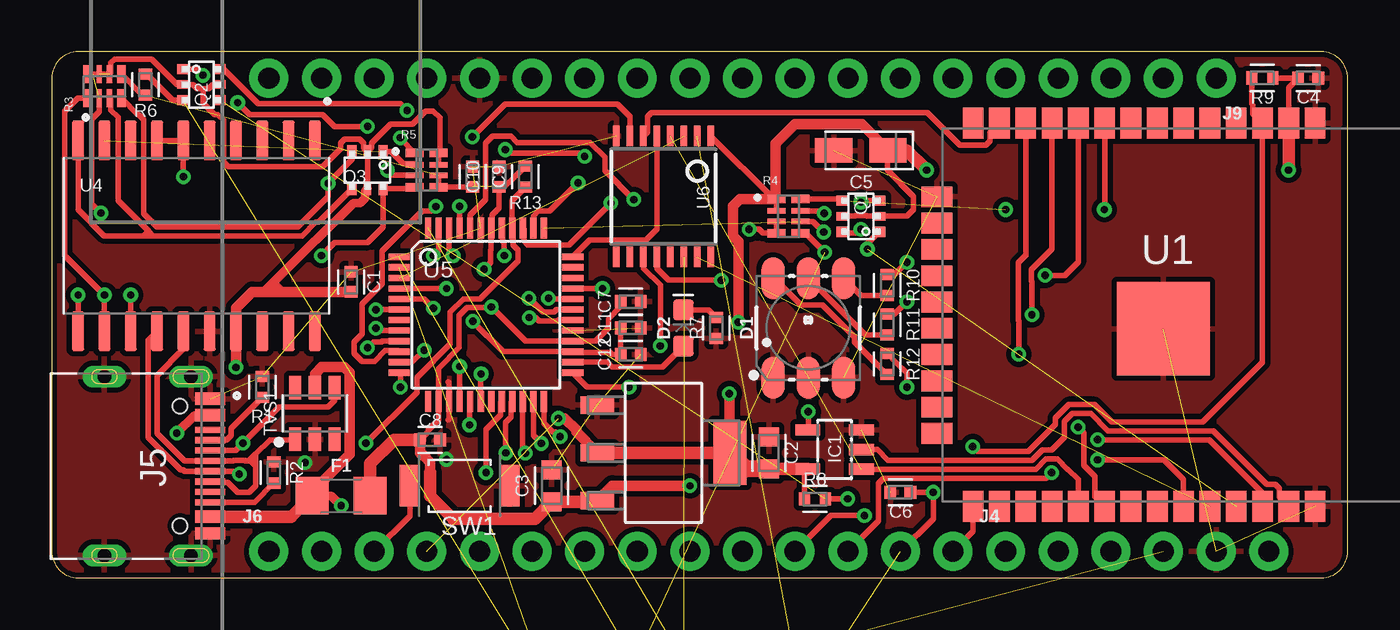
[diagram p2: board, top side]
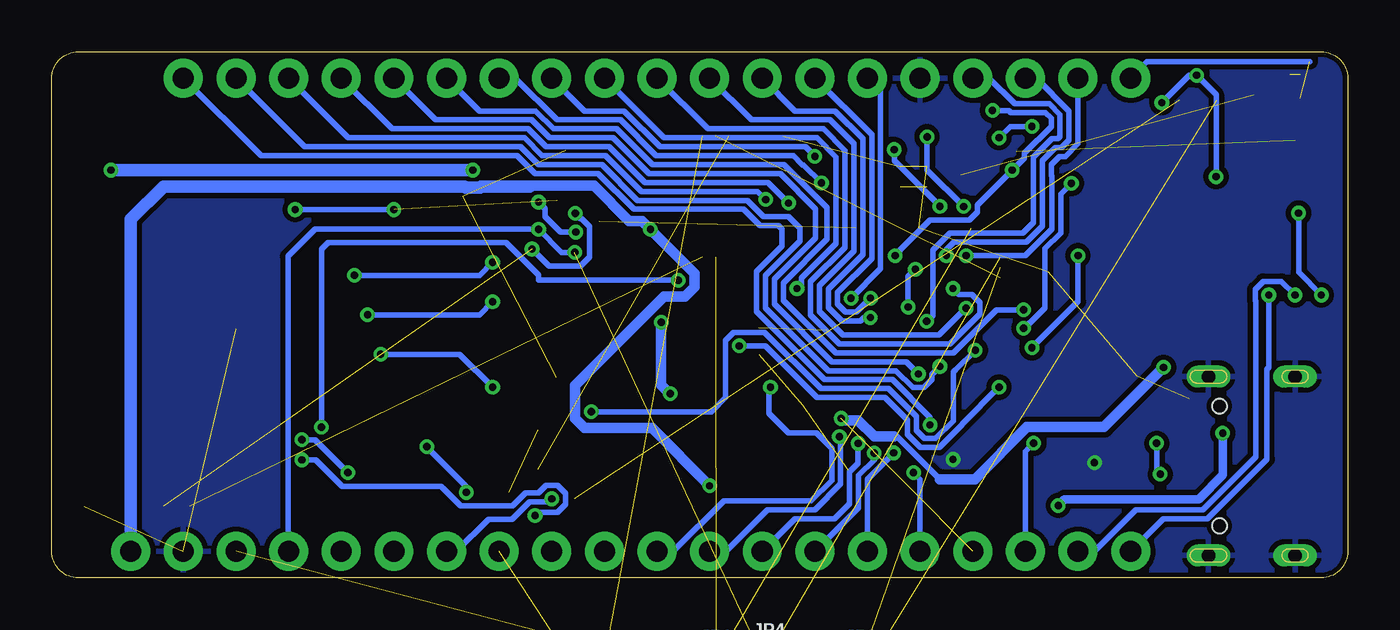
[diagram p3: board, bottom side, seen from below]

Size 62.55 x 25.4 mm. Coordinates in mm from the lower left corner, seen from the top.
Outline: 0,24.13 0,1.27 arc90 1.27,0 61.28,0 arc90 62.55,1.27 62.55,24.13 arc90 61.28,25.4 1.27,25.4 arc90 0,24.13
Copper layers (1*16): Top 0.035mm / dielectric 1.5mm / Bottom 0.035mm
Design rules "SparkFun-2-Layer-General-JLCPCB": minimum track width 7mil, minimum drill 0.3mm, track to track 7mil, track to pad 7mil, pad to pad 7mil, via to via 7mil, smd to smd 7mil, copper to edge 7mil, drill to drill 7mil, minimum pad ring 7mil, minimum via ring 7mil, stop-mask expansion 3mil, vias tented up to drill 25mil, thermal gap 10mil

### Footprints (pad centres in the part's own frame; a part is rotated, then mirrored left to right if it is on the bottom)
ARDUINO_R3 = drill 1.016 pad 1.93: 3.3V 2.54,-24.13; 5V 5.08,-24.13; A0 17.78,-24.13; A1 20.32,-24.13; A2 22.86,-24.13; A3 25.4,-24.13; A4 27.94,-24.13; A5 30.48,-24.13; AREF -9.144,24.13; D0 30.48,24.13; D1 27.94,24.13; D2 25.4,24.13; D3 22.86,24.13; D4 20.32,24.13; D5 17.78,24.13; D6 15.24,24.13; D7 12.7,24.13; D8 8.636,24.13; D9 6.096,24.13; D10 3.556,24.13; D11 1.016,24.13; D12 -1.524,24.13; D13 -4.064,24.13; GND@1 7.62,-24.13; GND@2 10.16,-24.13; GND@3 -6.604,24.13; GND@4 33.16,-1.32; IOREF -2.54,-24.13; MISO 30.62,3.76; MOSI 33.16,1.22; NC -5.08,-24.13; RESET@1 0,-24.13; RESET@2 30.62,-1.32; SCK 30.62,1.22; SCL -14.224,24.13; SDA -11.684,24.13; VCC 33.16,3.76; VIN 12.7,-24.13 | hole 3.175: -17.78,24.13; 33.02,8.89; 33.02,-19.05; -19.05,-24.13
CAPC1005X60 = smd 0.56 x 0.629: 1 -0.485,0; 2 0.485,0
CAPC1608X85 = smd 0.921 x 0.97: 1 -0.775,0; 2 0.775,0
CAPMP3216X180N = smd 1.796 x 1.189: 1 -1.31,0; 2 1.31,0
LED-TRICOLOR-5050 = smd 2 x 1.1: 1 2.4,-1.7; 2 2.4,0; 3 2.4,1.7; 4 -2.4,1.7; 5 -2.4,0; 6 -2.4,-1.7
LED-0603 = smd 1 x 1: A -0.877,0; C 0.877,0
1206 = smd 1.6 x 1.8: 1 -1.4,0; 2 1.4,0
SOT23-5L = smd 0.55 x 1.2: 1 -0.95,-1.3; 2 0,-1.3; 3 0.95,-1.3; 4 0.95,1.3; 5 -0.95,1.3
1X06_NO_SILK = drill 1.016 pad 1.88: 1 0,0; 2 2.54,0; 3 5.08,0; 4 7.62,0; 5 10.16,0; 6 12.7,0
HRO_TYPE-C-31-M-12 = smd 0.6 x 1.45: A1B12 -3.25,5.095; A4B9 -2.45,5.095; B1A12 3.25,5.095; B4A9 2.45,5.095 | smd 0.3 x 1.45: A5 -1.25,5.095; A6 -0.25,5.095; A7 0.25,5.095; A8 1.25,5.095; B5 1.75,5.095; B6 0.75,5.095; B7 -0.75,5.095; B8 -1.75,5.095 | drill 0.65 pad 1.05 long: S1 -4.32,4.18; S2 4.32,4.18; S3 -4.32,0; S4 4.32,0 | hole 0.7: -2.89,3.65; 2.89,3.65
1X14_NO_SILK = drill 1.016 pad 1.88: 1 0,0; 2 2.54,0; 3 5.08,0; 4 7.62,0; 5 10.16,0; 6 12.7,0; 7 15.24,0; 8 17.78,0; 9 20.32,0; 10 22.86,0; 11 25.4,0; 12 27.94,0; 13 30.48,0; 14 33.02,0
1X19_NO_SILK = drill 1.016 pad 1.88: 1 0,0; 2 2.54,0; 3 5.08,0; 4 7.62,0; 5 10.16,0; 6 12.7,0; 7 15.24,0; 8 17.78,0; 9 20.32,0; 10 22.86,0; 11 25.4,0; 12 27.94,0; 13 30.48,0; 14 33.02,0; 15 35.56,0; 16 38.1,0; 17 40.64,0; 18 43.18,0; 19 45.72,0
SMT-JUMPER_2_NO_SILK = smd 0.635 x 1.27: 1 -0.406,0; 2 0.406,0
SMT-JUMPER_2_NC_TRACE_SILK = smd 0.635 x 1.27: 1 -0.508,0; 2 0.508,0
ARDUINO-TRANSISTORS_SOT363 = smd 0.5 x 0.6: 1 -0.75,-0.9; 3 0.75,-0.9; 4 0.75,0.9; 6 -0.75,0.9 | smd 0.4 x 0.6: 2 0,-0.9; 5 0,0.9
RESC1005X40 = smd 0.535 x 0.644: 1 -0.507,0; 2 0.507,0
RESPACK_4X0402 = smd 0.87 x 0.41: 1 -0.58,0.825; 4 -0.58,-0.825; 5 0.58,-0.825; 8 0.58,0.825 | smd 0.87 x 0.26: 2 -0.58,0.25; 3 -0.58,-0.25; 6 0.58,-0.25; 7 0.58,0.25
SW2-2.6-3.9X2.9X1.5+0.4MM = smd 1 x 2: 1 -2.4,0; 2 2.4,0
SOT95P280X110-6N = smd 1.119 x 0.584: 1 -1.246,0.95; 2 -1.246,0; 3 -1.246,-0.95; 4 1.246,-0.95; 5 1.246,0; 6 1.246,0.95
ESP-32S = smd 1.5 x 1: 1 -9.25,7; 2 -9.25,5.73; 3 -9.25,4.46; 4 -9.25,3.19; 5 -9.25,1.92; 6 -9.25,0.65; 7 -9.25,-0.62; 8 -9.25,-1.89; 9 -9.25,-3.16; 10 -9.25,-4.43; 11 -9.25,-5.7; 12 -9.25,-6.97; 13 -9.25,-8.24; 14 -9.25,-9.51; 25 9.25,-9.51; 26 9.25,-8.24; 27 9.25,-6.97; 28 9.25,-5.7; 29 9.25,-4.43; 30 9.25,-3.16; 31 9.25,-1.89; 32 9.25,-0.62; 33 9.25,0.65; 34 9.25,1.92; 35 9.25,3.19; 36 9.25,4.46; 37 9.25,5.73; 38 9.25,7 | smd 1 x 1.5: 15 -5.7,-11.25; 16 -4.43,-11.25; 17 -3.16,-11.25; 18 -1.89,-11.25; 19 -0.62,-11.25; 20 0.65,-11.25; 21 1.92,-11.25; 22 3.19,-11.25; 23 4.46,-11.25; 24 5.73,-11.25 | smd 4.5 x 4.5: GND 0.68,-0.33
SOT230P696X180-4N = smd 1.6 x 0.838: 1 -3.2,2.311; 2 -3.2,0; 3 -3.2,-2.311 | smd 1.6 x 3.099: 4 3.2,0
SOIC127P1030X265-20N = smd 1.9 x 0.6: 1 -4.605,5.715; 2 -4.605,4.445; 3 -4.605,3.175; 4 -4.605,1.905; 5 -4.605,0.635; 6 -4.605,-0.635; 7 -4.605,-1.905; 8 -4.605,-3.175; 9 -4.605,-4.445; 10 -4.605,-5.715; 11 4.605,-5.715; 12 4.605,-4.445; 13 4.605,-3.175; 14 4.605,-1.905; 15 4.605,-0.635; 16 4.605,0.635; 17 4.605,1.905; 18 4.605,3.175; 19 4.605,4.445; 20 4.605,5.715
TQFP48 = smd 1.016 x 0.305: 1 -4.191,2.794; 2 -4.191,2.286; 3 -4.191,1.778; 4 -4.191,1.27; 5 -4.191,0.762; 6 -4.191,0.254; 7 -4.191,-0.254; 8 -4.191,-0.762; 9 -4.191,-1.27; 10 -4.191,-1.778; 11 -4.191,-2.286; 12 -4.191,-2.794; 25 4.191,-2.794; 26 4.191,-2.286; 27 4.191,-1.778; 28 4.191,-1.27; 29 4.191,-0.762; 30 4.191,-0.254; 31 4.191,0.254; 32 4.191,0.762; 33 4.191,1.27; 34 4.191,1.778; 35 4.191,2.286; 36 4.191,2.794 | smd 0.305 x 1.016: 13 -2.794,-4.191; 14 -2.286,-4.191; 15 -1.778,-4.191; 16 -1.27,-4.191; 17 -0.762,-4.191; 18 -0.254,-4.191; 19 0.254,-4.191; 20 0.762,-4.191; 21 1.27,-4.191; 22 1.778,-4.191; 23 2.286,-4.191; 24 2.794,-4.191; 37 2.794,4.191; 38 2.286,4.191; 39 1.778,4.191; 40 1.27,4.191; 41 0.762,4.191; 42 0.254,4.191; 43 -0.254,4.191; 44 -0.762,4.191; 45 -1.27,4.191; 46 -1.778,4.191; 47 -2.286,4.191; 48 -2.794,4.191
TSSOP16 = smd 0.305 x 0.991: 1 -2.275,-2.918; 2 -1.625,-2.918; 3 -0.975,-2.918; 4 -0.325,-2.918; 5 0.325,-2.918; 6 0.975,-2.918; 7 1.625,-2.918; 8 2.275,-2.918; 9 2.275,2.918; 10 1.625,2.918; 11 0.975,2.918; 12 0.325,2.918; 13 -0.325,2.918; 14 -0.975,2.918; 15 -1.625,2.918; 16 -2.275,2.918

### Placement (x,y rotation side)
B1  41.27,11.43 0 top
C1  14.45,14.29 90 top
C2  34.61,6.03 90 top
C3  24.13,4.45 90 top
C4  60.64,24.13 0 top
C5  39.05,20.64 180 top
C6  40.96,4.13 0 top
C7  27.94,13.34 0 top
C8  18.26,6.67 0 top
C9  20.32,19.37 90 top
C10  21.59,19.37 90 top
C11  27.94,12.06 0 top
C12  27.94,10.79 0 top
D1  36.51,12.06 270 top
D2  30.48,12.06 90 top
F1  13.97,3.97 0 top
IC1  37.78,6.19 90 top
J4  46.04,1.27 0 top
J5  2.54,5.4 270 top
J6  10.48,1.27 0 top
J9  56.2,24.13 180 top
JP1  30.48,-4.45 270 bottom  (outside the outline)
JP2  23.5,-4.45 270 bottom  (outside the outline)
JP3  36.51,-4.76 180 bottom  (outside the outline)
JP4  27.94,-4.13 270 bottom  (outside the outline)
Q1  39.05,17.46 90 top
Q2  7.22,23.81 270 top
Q3  15.24,19.68 180 top
R1  10.16,9.21 90 top
R2  10.72,5.08 270 top
R3  2.54,23.73 90 top
R4  35.56,17.46 0 top
R5  18.1,19.68 0 top
R6  4.52,23.81 90 top
R7  32.07,12.06 270 top
R8  36.83,3.81 180 top
R9  58.42,24.13 0 top
R10  40.32,14.13 270 top
R11  40.32,12.22 270 top
R12  40.32,10.32 270 top
R13  22.86,19.37 90 top
SW1  19.68,4.45 180 top
TVS1  12.7,7.94 90 top
U1  53.98,12.7 270 top
U3  29.53,6.03 0 top
U4  6.99,16.51 270 top
U5  20.95,12.7 0 top
U6  29.53,18.41 180 top

### Tracks (layer width: path | path; a pad name or v marks a point on that pad's centre or on a via)
3.3V  (via drill 0.35)  (2 unrouted)
  Top 0.254: U1.2 59.7,23.68 C4.1 R9.2 | R4.2 R4.1 34.85,18.29 U6.1 | IC1.5 36.32,5.08 R8.2 | R5.7 R5.8 18.73,20.57 18.73,22.23 18.41,22.54 18.05,22.54 17.42,21.91 16.35,21.91 15.44,21 15.44,20.78 Q3.2 | Q3.5 Q3.2 | C5.1 40.32,20.6 40.32,19.68 41.59,18.41 41.59,17.78 41.27,17.46 Q1.2 39.35,17.46 39.33,17.48 38.78,17.48 38.76,17.46 Q1.5 | 7.3,23.61 7.02,23.61 6.82,23.81 Q2.2 6.05,23.81 4.81,25.05 3.03,25.05 2.85,24.87 2.85,24.38 R3.6 R3.8 | 7.3,23.61 7.57,23.61 7.77,23.81 Q2.5 | 7.3,23.61 7.3,22.92 7.85,22.37 8,22.37 8.29,22.09 8.29,20.08 8.51,19.86 13.08,19.86 13.94,20.71 13.94,21 14.13,21.19 14.85,21.19 15.04,21 15.04,20.78 Q3.2
  Top 0.406: Q3.5 15.12,18.67 15.12,18.34 14.88,18.1 14.56,18.1 12.75,16.29 12.71,16.29 10.75,14.33 | 10.16,13.8 10.22,13.8 10.75,14.33 | 11.11,13.8 10.75,14.16 10.75,14.33
  Top 0.508: v32.7,8.89 32.7,6.06 U3.4 | C1.1 11.11,13.8 10.16,13.8 9.68,13.8 8.89,13.02 U4.17 v8.89,10.16 | U3.2 25.32,7.04 25.32,7.14 24.76,7.7 v24.45,7.7 | v33.13,12.34 33.13,16.24 32.87,16.5 32.87,17.95 33.21,18.29 R4.1 34.92,18.34 34.92,20.95 35.88,21.91 39.09,21.91 C5.1
  Top 0.61: C2.1 36.47,5.26 IC1.5 | U3.2 U3.4 | U1.2 59.7,19.7 v59.69,19.68 | C5.1 41.27,20.64 v42.23,19.68
  Top 0.813: C2.1 33.5,5.26 U3.4
  Bottom 0.254: 19.68,4.76 20.78,5.86 20.79,5.86 21.75,6.82 21.91,6.82
  Bottom 0.508: v33.13,12.34 33.13,9.32 v32.7,8.89 | v24.45,7.7 24.35,7.6 23.64,7.6 22.85,6.82 21.91,6.82 | 19.68,4.76 18,4.76 15.48,7.28 11.77,7.28 v8.89,10.16
  Bottom 0.61: v59.69,19.68 v42.23,19.68
5V  (via drill 0.35)  (2 unrouted)
  Top 0.254: R13.2 22.42,19.43 22.41,19.43 21.86,18.88 C10.1 21.59,17.86 21.26,17.52 21.26,16.94 U5.42 21.21,15.86 21.18,15.83 21.18,15.22 v20.86,14.9 | R4.3 R4.4 34.32,16.64 34.13,16.83 v33.66,16.83 | C9.1 20.3,18.86 R5.5 R5.6 | C7.1 27.45,13.09 26.87,12.51 26.87,12.06 26.24,11.43 U5.28 22.86,11.43 v21.21,13.07 21.18,13.04 20.05,13.04 19.66,12.65 19.66,11.11 18.67,10.12 U5.14 18.67,7.62 18.16,7.11 18.16,7.05 C8.1 | R3.5 4.37,23.3 R6.1
  Top 0.508: C8.1 17.78,6.03 17.94,5.88 17.96,5.88 18.27,5.57 18.27,5.08 | U3.3 27.05,4.45 v30.8,4.45
  Top 0.61: U3.3 26.28,3.67 C3.1 23.32,2.86 19.37,2.86 18.27,3.96 18.27,5.08 | C8.1 16.51,6.67 15.37,5.53 F1.2
  Bottom 0.254: v21.21,13.07 21.21,14.55 v20.86,14.9
  Bottom 0.508: 39.48,18.9 39.41,18.9 39.38,18.93 36.38,18.93 34.68,17.23 34.06,17.23 v33.66,16.83 31.52,14.69 31.52,14.04 31.98,13.58 33,13.58 37.3,9.28 37.3,7.69 36.84,7.23 33.59,7.23 v30.8,4.45
  Bottom 0.61: J4.6 58.74,17.31 57.15,18.9 42.62,18.9 42.57,18.85 41.88,18.85 41.83,18.9 39.48,18.9
BLU
  Top 0.254: R12.2 39.88,10.25 39.87,10.25 38.73,11.39 38.73,11.63 37.21,13.16 36.16,13.16 34.85,14.46 D1.6
CC1
  Top 0.254: R1.1 8.66,7.21 8.66,6.87 8.44,6.65 J5.A5
CC2
  Top 0.254: J5.B5 9.79,3.65 R2.2
D_N  (via drill 0.35)
  Top 0.254: U4.14 4.65,11.47 4.65,6.79 6.22,5.22 6.33,5.22 6.4,5.15 J5.A7 8.9,5.15 v9.05,5 | J5.B7 8.87,6.15 v9.22,6.5 10.98,8.26 13.34,8.26 13.65,8.57 TVS1.4
  Bottom 0.254: v9.05,5 9.22,5.17 v9.22,6.5
D_P
  Top 0.254: U4.15 6.35,11.05 5.08,9.78 5.08,6.97 6.4,5.65 J5.A6 8.77,5.65 8.78,5.66 9.32,5.66 9.33,5.65 9.51,5.65 | J5.B6 7.68,4.6 8.49,4.6 8.96,4.13 9.53,4.13 9.84,4.45 9.84,5.4 | TVS1.1 11.73,6.67 10.53,6.67 9.84,5.98 | 9.84,5.98 9.51,5.65 | 9.84,5.4 9.84,5.98 | 9.51,5.65 9.59,5.65 9.84,5.4
ESP_ACK  (via drill 0.35)  (1 unrouted)
  Top 0.254: R4.8 38.08,18.29 Q1.4 | U1.9 50.81,17.8 v50.8,17.78
  Bottom 0.254: v50.8,17.78 v46.04,17.78
ESP_BLUE  (via drill 0.35)
  Top 0.254: v46.67,10.79 46.67,12.4 46.65,12.43 46.65,15.22 46.99,15.56 47.01,15.57 U1.12 | R12.1 40.77,10.38 41.27,9.88 v41.27,9.21
  Bottom 0.254: v46.67,10.79 42.86,10.79 v41.27,9.21
ESP_CS  (1 unrouted)
  Top 0.254: U1.29 49.55,4.75 49.05,5.24 49.03,5.24 48.53,5.74 47.99,5.74 47.49,5.24 IC1.1
ESP_EN  (via drill 0.35)  (1 unrouted)
  Top 0.254: R9.1 57.91,22.88 57.97,22.83 57.97,22.41 U1.3 58.44,10.4 55.56,7.53 51.16,7.53 50.32,8.37 49.08,8.37 48.44,7.73 48.44,7.41 47.13,6.11 44.68,6.11 v44.45,6.33 | C6.2 v42.55,4.13 42.55,2.86 J6.13
  Bottom 0.254: v44.45,6.33 42.55,4.43 v42.55,4.13
ESP_GREEN  (via drill 0.35)
  Top 0.254: v41.27,15.24 40.67,14.64 R10.1 | v47.94,14.61 48.9,14.61 49.55,15.26 U1.10
  Bottom 0.254: v47.94,14.61 41.91,14.61 v41.27,15.24
ESP_IO0  (via drill 0.35)  (1 unrouted)
  Top 0.254: J6.14 44.47,2.24 U1.25 | R8.1 v38.42,3.81
  Bottom 0.254: v38.42,3.81 38.56,3.66 39.49,3.66 40.33,2.83 41.47,2.83 43.03,1.27 J6.14
ESP_MISO
  Top 0.254: U1.37 59.24,3.92 59.24,4.33 59.06,4.5 58.65,4.5 56.06,7.1 50.98,7.1 50.14,7.94 49.26,7.94 48.87,7.55 48.87,6.78 48.26,6.17 47.81,6.17 47.31,5.67 40.36,5.67 39.85,6.19 IC1.2
ESP_MOSI
  Top 0.254: U6.6 28.75,21.53 28.75,22.27 28.94,22.47 42.27,22.47 43.84,20.89 45.09,20.89 45.27,21.07 45.27,21.48 U1.13
ESP_RED  (via drill 0.35)
  Top 0.254: v41.27,13.34 40.67,12.73 R11.1 | v47.31,12.7 47.31,14.31 47.28,14.33 47.28,14.88 48.27,15.87 U1.11
  Bottom 0.254: v47.31,12.7 41.91,12.7 v41.27,13.34
ESP_RX  (1 unrouted)
ESP_RX_5V  (2 unrouted)
ESP_SCK  (via drill 0.35)
  Top 0.254: U1.30 50.35,3.92 50.35,4.89 49.83,5.42 49.83,6.99 v49.53,7.28 | U6.12 29.21,14.92 29.77,14.37 v32.31,14.37
  Bottom 0.254: v49.53,7.28 49.53,15.88 49.21,16.19 40.62,16.19 39.05,14.63 39.05,14.37 v32.31,14.37
ESP_SCL  (via drill 0.35)
  Top 0.254: J6.12 39.89,2.74 39.89,4.57 40.13,4.81 47.99,4.81 v48.26,5.08 | U1.36 58.44,4.11 55.88,6.67 v50.48,6.67
  Bottom 0.254: v48.26,5.08 49.85,6.67 v50.48,6.67
ESP_SDA  (via drill 0.35)
  Top 0.254: J6.11 37.61,3 v39.22,3 | v50.48,5.69 53.68,5.69 54.62,4.75 U1.33
  Bottom 0.254: v50.48,5.69 49.8,5.69 48.53,4.42 43.77,4.42 42.82,3.47 40.3,3.47 39.67,4.09 39.06,4.09 38.69,4.47 38.15,4.47 37.76,4.08 37.76,3.54 38.15,3.15 39.08,3.15 v39.22,3
ESP_TX  (via drill 0.35)  (1 unrouted)
  Top 0.254: R4.7 37.17,17.71 v37.28,17.6 | v39.37,15.88 39.37,16.13 Q1.1
  Bottom 0.254: v37.28,17.6 37.04,17.36 36.98,17.36 36.6,16.97 36.6,15.49 37.03,15.06 38.55,15.06 v39.37,15.88
ESP_TX_5V  (via drill 0.35)  (1 unrouted)
  Top 0.254: Q1.6 38.08,16.64 38.86,16.64 v39.05,16.83 | v37.31,15.72 36.38,16.64 R4.5
  Bottom 0.254: J4.3 51.14,1.29 51.14,15.54 49.85,16.83 v39.05,16.83 37.94,15.72 v37.31,15.72
GND  (via drill 0.35)  (14 unrouted)
  Top 0.254: 19.13,9.45 19.18,9.4 U5.15 19.18,7.67 19.13,7.62
  other vias: 12.22,5.56 19.05,5.71
  pour Top (isolate 0.254): 0,25.4 62.23,25.4 62.23,0 0,0
  pour Bottom (isolate 0.254): 0,25.4 62.23,25.4 62.23,0 0,0
GRN
  Top 0.254: R10.2 39.06,13.62 D1.4
IO0_5V  (1 unrouted)
  Top 0.254: Q2.3 5.83,23.06 4.57,24.32 R6.2
N$2
  Top 0.254: D2.C 31.7,12.94 R7.1
N$4  (1 unrouted)
PA0_D2  (via drill 0.35)
  Top 0.254: v28.09,18.27 26.69,19.66 26.69,20.31 25.98,21.02 22.47,21.02 22.16,21.33 21.27,21.33 20.94,21 20.94,18.26 20.19,17.52 U5.44
  Bottom 0.254: J9.3 48.23,21.25 39.74,21.25 38.87,20.38 35.82,20.38 34.09,18.66 28.48,18.66 v28.09,18.27
PA1_D7  (via drill 0.35)
  Top 0.254: v25.72,20.35 25.56,20.51 22.05,20.51 v21.89,20.67 | v19.68,17.94 U5.45
  Bottom 0.254: v21.89,20.67 21.89,20.14 v19.68,17.94 | v25.72,20.35 26.18,20.82 33.2,20.82 34.92,22.54 36.83,22.54 J9.8
PA2_D20_SDA  (via drill 0.35)
  Top 0.254: v19.37,15.56 19.18,15.75 U5.46
  Bottom 0.254: v19.37,15.56 19.37,15.85 19,16.21 15.51,16.21 14.74,16.98 14.74,20.14 14.1,20.77 13.81,20.77 13.45,21.13 13.45,21.91 13.45,22.02 13.45,22.54 15.04,24.13 J9.17
PA3_D21_SCL  (via drill 0.35)
  Top 0.254: v18.41,15.56 18.67,15.81 U5.47
  Bottom 0.254: J9.18 13.02,20.95 13.63,20.34 13.93,20.34 14.31,19.96 14.31,19.41 14.29,19.39 14.29,16.83 15.56,15.56 v18.41,15.56
PA4_D24_TX2  (1 unrouted)
PA5_D23_RX2  (1 unrouted)
PA6_D28  (1 unrouted)
PA7_D29  (1 unrouted)
PB0_D9~  (via drill 0.35)
  Top 0.254: v19.05,13.97 U5.4
  Bottom 0.254: J9.10 30.89,21.68 25.31,21.68 24.27,20.64 24.27,15.96 25.92,14.3 25.92,12.69 24.53,11.29 19.21,11.29 17.76,12.74 17.76,13.29 18.14,13.68 18.75,13.68 v19.05,13.97
PB1_D10~  (via drill 0.35)
  Top 0.254: U5.5 17.97,13.46 v18.41,13.02
  Bottom 0.254: J9.11 28.78,22.11 24.99,22.11 23.84,20.95 23.84,15.78 25.49,14.12 25.49,12.86 24.35,11.72 19.73,11.72 18.44,13.02 v18.41,13.02
PB2_D5~  (via drill 0.35)
  Top 0.254: v15.64,12.94 15.65,12.95 U5.6
  Bottom 0.254: J9.6 41.91,22.54 39.2,22.54 38.34,21.68 35.28,21.68 33.56,19.95 27.21,19.95 25.13,17.87 25.13,16.35 27.24,14.24 27.24,13.39 24.71,10.86 19.03,10.86 16.95,12.94 v15.64,12.94
PB4_D27_TX0  (via drill 0.35)
  Top 0.254: U5.8 15.75,11.94 v15.64,12.05 | Q3.3 14.49,20.2 v13.34,19.05 13.34,18.41 11.86,16.94 5.08,16.94 4.45,17.58 4.45,22.12 4.19,22.37 4.15,22.37 R3.4
  Bottom 0.254: v15.64,12.05 15.41,12.28 15.36,12.28 14.62,13.03 14.62,15.89 13.86,16.65 13.86,18.53 v13.34,19.05
PB5_D26_RX0  (via drill 0.35)
  Top 0.254: R5.4 17.44,18.79 Q3.6 15.99,16.94 15.24,16.19 13.65,16.19 v13.02,15.56 | U5.9 15.94,11.43 15.91,11.4 15.53,11.4 v15.24,11.11
  Bottom 0.254: v15.24,11.11 13.02,13.34 v13.02,15.56
PC0_MOSI  (via drill 0.35)
  Top 0.254: v18.54,17.93 18.31,17.7 17.88,17.7 15.95,15.77 15.95,14.18 14.98,13.21 14.98,11.78 14.58,11.38 14.58,10.84 14.97,10.46 15.58,10.46 16.1,10.97 16.71,10.97 U5.10 | U6.7 27.9,22.26 27.3,22.86 21.87,22.86 v20.3,21.29
  Bottom 0.254: v20.3,21.29 20.3,19.7 v18.54,17.93
PC1_MISO  (via drill 0.35)
  Top 0.254: U5.11 17.4,10.41 v17.97,10.99 | v36.51,8.02 36.51,7.17 IC1.4
  Bottom 0.254: v17.97,10.99 18.93,10.04 19.03,9.93 19.03,7.59 19.89,6.72 20.43,6.72 20.82,7.11 20.82,7.79 22.16,9.13 25.43,9.13 28.15,11.86 29.53,11.86 29.64,11.86 30.03,11.47 30.03,8.71 30.72,8.02 v36.51,8.02
PC2_SCK  (via drill 0.35)
  Top 0.254: U5.12 16.83,9.84 v16.83,9.21 | v29.37,11.2 29.37,14.13 28.55,14.95 U6.11
  Bottom 0.254: v16.83,9.21 18.6,7.44 18.6,7.41 19.71,6.29 20.61,6.29 21.25,6.93 21.25,7.61 22.34,8.7 25.61,8.7 28.1,11.2 v29.37,11.2
PC4_D1_TX1  (via drill 0.35)
  Top 0.254: v19.68,10.2 U5.16
  Bottom 0.254: J9.2 50.34,20.82 40.01,20.82 39.92,20.82 39.05,19.95 36,19.95 34.27,18.22 33.34,18.22 28.97,18.22 28.19,17.44 26.99,17.44 26.43,16.89 26.43,16.27 28.1,14.6 28.1,13.03 25.07,10 21.8,10 20.99,9.19 20.44,9.19 20.06,9.57 20.06,9.83 v19.68,10.2
PC5_D0_RX1  (via drill 0.35)
  Top 0.254: v20.16,7.38 20.16,8.48 U5.17
  Bottom 0.254: J9.1 52.45,20.38 40.09,20.38 39.23,19.52 36.18,19.52 34.45,17.79 29.15,17.79 28.37,17.01 27.49,17.01 27.3,16.83 27.3,16.01 28.54,14.78 28.54,12.85 25.25,9.57 21.98,9.57 20.16,7.75 v20.16,7.38
PC6_D4  (via drill 0.35)
  Top 0.254: v20.72,9.84 20.7,9.83 U5.18
  Bottom 0.254: J9.5 44.02,22.11 39.38,22.11 38.52,21.25 35.46,21.25 33.73,19.52 27.39,19.52 25.68,17.81 25.68,16.41 27.67,14.42 27.67,13.21 24.89,10.43 21.3,10.43 v20.72,9.84
PD0_A0  (via drill 0.35)
  Top 0.254: U5.20 21.67,8.46 21.67,7.88 20.95,7.16 v20.95,5.08
  Bottom 0.254: J6.5 20.64,4.76 v20.95,5.08
PD1_A1  (via drill 0.35)
  Top 0.254: v21.91,6.03 21.91,7.5 22.17,7.77 22.17,8.46 U5.21
  Bottom 0.254: J6.6 23.18,4.76 v21.91,6.03
PD2_A2  (via drill 0.35)
  Top 0.254: v22.85,6.02 22.73,6.14 U5.22
  Bottom 0.254: J6.7 23.61,3.38 23.61,4.94 22.85,5.7 v22.85,6.02
PD3_A3  (via drill 0.35)
  Top 0.254: v23.63,6.49 23.24,6.88 U5.23
  Bottom 0.254: J6.8 26.67,2.86 24.77,2.86 24.04,3.58 24.04,5.12 23.63,5.53 v23.63,6.49
PD4_A4  (via drill 0.35)
  Top 0.254: v24.53,6.82 24.31,7.04 24.18,7.04 23.75,7.47 U5.24
  Bottom 0.254: J6.9 30.02,1.27 28,3.29 25.72,3.29 24.47,4.53 24.47,6.75 v24.53,6.82
PD5_A5  (via drill 0.35)
  Top 0.254: v27.86,9.21 25.84,9.21 U5.25
  Bottom 0.254: J6.10 32.56,1.27 30.11,3.72 25.9,3.72 24.91,4.71 24.91,6.25 25.64,6.99 26.99,6.99 27.94,7.94 27.94,9.13 v27.86,9.21
PD6_A6
  Top 0.254: U5.26 26.81,10.41 27.05,10.18 29.47,10.18 D2.A
PD7_A7_AREF  (via drill 0.35)
  Top 0.254: v20.32,12.38 21.78,10.92 U5.27 25.2,10.87 26.96,10.87 27.04,10.79 C12.1 C11.1
  Bottom 0.254: v20.32,12.38 20.02,12.68 20.02,15.83 19.21,16.65 15.69,16.65 15.17,17.16 15.17,20.32 14.28,21.21 13.99,21.21 13.88,21.31 13.88,22.36 14.4,22.89 16.07,22.89 17.32,24.13 J9.16
PE0_D11  (via drill 0.35)
  Top 0.254: v23.04,12.56 23.36,12.56 23.52,12.4 24.42,12.4 24.46,12.45 U5.30
  Bottom 0.254: J9.12 26.67,22.54 24.74,22.54 23.41,21.21 23.41,15.6 25.06,13.95 25.06,13.04 24.42,12.4 23.52,12.4 23.36,12.56 v23.04,12.56
PE1_D12  (via drill 0.35)
  Top 0.254: U5.31 24.36,12.95 24.24,12.84 23.7,12.84 v23.03,13.51
  Bottom 0.254: J9.13 22.97,21.39 22.97,15.42 24.63,13.77 24.63,13.22 24.24,12.84 23.7,12.84 v23.03,13.51
PE2_D13  (via drill 0.35)
  Top 0.254: v23.97,13.49 24,13.46 U5.32
  Bottom 0.254: J9.14 22.54,23.5 22.54,14.92 v23.97,13.49
PE3_D8  (via drill 0.35)
  Top 0.254: v26.58,13.97 U5.33
  Bottom 0.254: J9.9 32.99,21.25 25.63,21.25 24.7,20.32 24.7,16.14 26.36,14.48 26.36,14.2 v26.58,13.97
PF2_D35_A12
  Top 0.254: U5.36 25.95,16.3 27.53,16.3 27.58,16.25 27.62,16.3 28.68,16.3 29.21,16.83 U6.5
PF3_D36_A13  (via drill 0.35)  (1 unrouted)
  Top 0.254: Q1.3 39.12,18.21 v39.05,18.14 | v37.26,16.7 36.74,17.21 R4.6
  Bottom 0.254: v39.05,18.14 38.73,17.82 38.73,17.44 37.99,16.7 v37.26,16.7
PF4_D6~  (via drill 0.35)
  Top 0.254: v25.4,19.07 24.03,17.7 23.47,17.7 23.24,17.47 U5.38
  Bottom 0.254: v25.4,19.07 26.26,19.93 26.31,19.93 26.76,20.38 33.38,20.38 35.1,22.11 38.16,22.11 40.18,24.13 J9.7
PF5_D3~  (via drill 0.35)
  Top 0.254: U5.39 22.78,16.84 22.78,16.26 22.96,16.08 24.97,16.08 v26.99,18.1
  Bottom 0.254: J9.4 46.13,21.68 39.56,21.68 38.7,20.82 35.64,20.82 33.91,19.09 27.98,19.09 v26.99,18.1
PF6_RST  (via drill 0.35)
  Top 0.254: J6.3 17.29,3 SW1.2 | R13.1 22.23,18.23 U5.40 22.23,16.41 22.27,16.36 22.27,16.06 22.5,15.83 22.5,15.29 20.68,13.47 19.87,13.47 19.23,12.83 19.23,11.29 17.62,9.68 17.62,9.21 17.62,8.96 v15.16,6.5
  Bottom 0.254: v15.16,6.5 15.56,6.1 J6.3
RED
  Top 0.254: R11.2 39.26,11.72 D1.5
RESETN  (via drill 0.35)  (1 unrouted)
  Top 0.254: U4.11 v1.27,13.65 | R3.2 2.29,22.5 1.94,22.15 1.94,18.05 v2.37,17.61
  Bottom 0.254: J9.19 9.68,24.92 1.83,24.92 | v2.37,17.61 2.37,14.75 v1.27,13.65
RX_D11
  Top 0.254: Q3.4 12.87,17.17 12.74,17.17 12.09,16.51 4.9,16.51 | U4.10 1.27,17.78 2.54,16.51 4.45,16.51 | 4.9,16.51 4.45,16.51 | R3.3 2.85,23.09 2.85,22.59 3.21,22.24 3.21,18.21 4.67,16.74 | 4.67,16.74 4.9,16.51 | 4.45,16.51 4.67,16.74
SWCLK  (via drill 0.35)
  Top 0.254: U4.12 v2.54,13.65 0.64,15.56 0.64,22.54 1.25,23.15 R3.1
  Bottom 0.254: J6.2 12.24,1.27 10.22,3.29 6.99,3.29 4.45,5.83 4.45,13.36 4.47,13.38 4.47,13.93 4.08,14.31 3.2,14.31 v2.54,13.65
SWDIO  (via drill 0.35)
  Top 0.254: v3.81,13.65 U4.13
  Bottom 0.254: J6.1 8.89,2.86 6.77,2.86 3.9,5.73 3.9,10.06 3.81,10.15 v3.81,13.65
TX_D11  (1 unrouted)
  Top 0.254: R5.2 17.45,20 16.96,20 16.37,20.59 Q3.1
UPDI_3V3  (via drill 0.35)
  Top 0.254: Q2.1 7,24.56 v7.29,24.27 | v6.35,19.37 U4.6 U4.7 | R5.1 16.83,21.2 v16.83,21.25 | v15.24,21.8 13.66,21.8 13.08,22.37 9.55,22.37 v8.97,22.94
  Bottom 0.254: v6.35,19.37 6.35,23.32 v7.29,24.27 7.65,24.27 v8.97,22.94 | v16.83,21.25 16.28,21.8 v15.24,21.8
UPDI_5V  (via drill 0.35)
  Top 0.254: Q2.6 8.29,24.56 9.23,23.62 9.23,23.61 9.96,22.89 16.82,22.89 v17.14,22.57 | R5.3 16.44,19.43 v16.19,19.68 | U5.41 21.77,16.84 21.77,16.26 21.84,16.19 v21.84,15.56
  Bottom 0.254: v17.14,22.57 16.36,22.57 16.25,22.45 14.58,22.45 14.31,22.18 14.31,21.79 15.61,20.49 15.61,20.27 v16.19,19.68 17.88,18 17.88,17.66 18.26,17.27 20.17,17.27 21.61,15.83 21.61,15.78 v21.84,15.56
V_USB  (via drill 0.35)
  Top 0.406: J5.A4B9 6.89,7.85 v6.03,6.99 | F1.1 13.49,3.97 v13.97,3.49
  Top 0.508: F1.1 12.57,4.15 14.37,5.95 14.37,9.92 14.12,10.18 13.03,10.18 12.7,9.84 TVS1.5
  Top 0.61: J5.B4A9 11.55,2.95 F1.1
  Bottom 0.406: v6.03,6.99 6.03,4.96 7.2,3.8 13.66,3.8 v13.97,3.49